# Altium schematic sheet Switch Matrix Driver.SchDoc
size A4; Organization: Altium Limited; Address1: L3, 12a Rodborough Rd; Address2: Frenchs Forest; Address3: NSW; Address4: Australia 2086
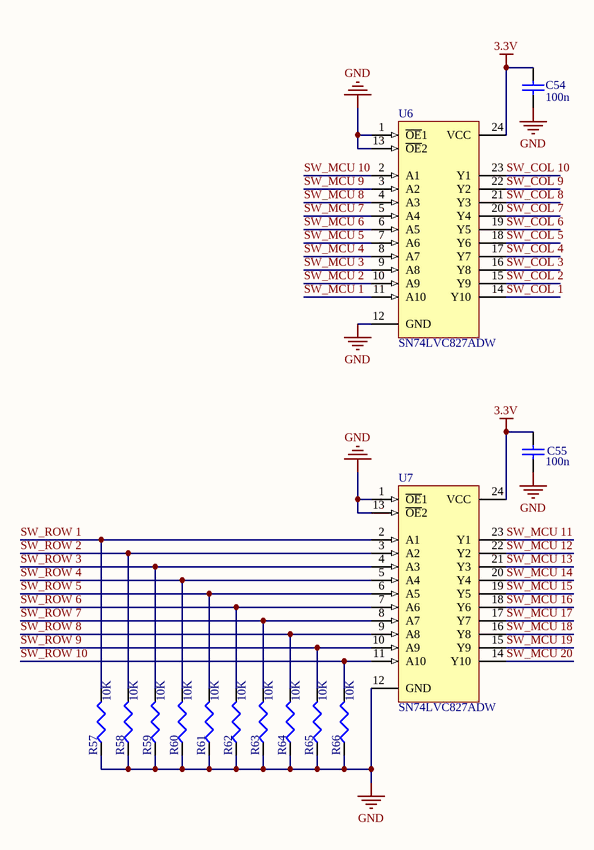
[diagram p0: Switch Matrix Driver.SchDoc]

## Parts
C54  value 100n  [0805C-GENERIC]  (hidden comment: Cap Semi)
C55  value 100n  [0805C-GENERIC]  (hidden comment: Cap Semi)
R57  value 10K  [0805R-GENERIC]  (hidden comment: Res3)
R58  value 10K  [0805R-GENERIC]  (hidden comment: Res3)
R59  value 10K  [0805R-GENERIC]  (hidden comment: Res3)
R60  value 10K  [0805R-GENERIC]  (hidden comment: Res3)
R61  value 10K  [0805R-GENERIC]  (hidden comment: Res3)
R62  value 10K  [0805R-GENERIC]  (hidden comment: Res3)
R63  value 10K  [0805R-GENERIC]  (hidden comment: Res3)
R64  value 10K  [0805R-GENERIC]  (hidden comment: Res3)
R65  value 10K  [0805R-GENERIC]  (hidden comment: Res3)
R66  value 10K  [0805R-GENERIC]  (hidden comment: Res3)
U6  SN74LVC827ADW  [SOIC24]
U7  SN74LVC827ADW  [SOIC24]

## Nets
3.3V: C54.2 C55.2 U6.24(VCC) U7.24(VCC)
GND: C54.1 C55.1 R57.1 R58.1 R59.1 R60.1 R61.1 R62.1 R63.1 R64.1 R65.1 R66.1 U6.1(~{OE}1) U6.12(GND) U6.13(~{OE}2) U7.1(~{OE}1) U7.12(GND) U7.13(~{OE}2)
SW_COL 1: U6.14(Y10)
SW_COL 2: U6.15(Y9)
SW_COL 3: U6.16(Y8)
SW_COL 4: U6.17(Y7)
SW_COL 5: U6.18(Y6)
SW_COL 6: U6.19(Y5)
SW_COL 7: U6.20(Y4)
SW_COL 8: U6.21(Y3)
SW_COL 9: U6.22(Y2)
SW_COL 10: U6.23(Y1)
SW_MCU 1: U6.11(A10)
SW_MCU 2: U6.10(A9)
SW_MCU 3: U6.9(A8)
SW_MCU 4: U6.8(A7)
SW_MCU 5: U6.7(A6)
SW_MCU 6: U6.6(A5)
SW_MCU 7: U6.5(A4)
SW_MCU 8: U6.4(A3)
SW_MCU 9: U6.3(A2)
SW_MCU 10: U6.2(A1)
SW_MCU 11: U7.23(Y1)
SW_MCU 12: U7.22(Y2)
SW_MCU 13: U7.21(Y3)
SW_MCU 14: U7.20(Y4)
SW_MCU 15: U7.19(Y5)
SW_MCU 16: U7.18(Y6)
SW_MCU 17: U7.17(Y7)
SW_MCU 18: U7.16(Y8)
SW_MCU 19: U7.15(Y9)
SW_MCU 20: U7.14(Y10)
SW_ROW 1: R57.2 U7.2(A1)
SW_ROW 2: R58.2 U7.3(A2)
SW_ROW 3: R59.2 U7.4(A3)
SW_ROW 4: R60.2 U7.5(A4)
SW_ROW 5: R61.2 U7.6(A5)
SW_ROW 6: R62.2 U7.7(A6)
SW_ROW 7: R63.2 U7.8(A7)
SW_ROW 8: R64.2 U7.9(A8)
SW_ROW 9: R65.2 U7.10(A9)
SW_ROW 10: R66.2 U7.11(A10)

## Notes on the sheet
- Title
- Size:
- Date:
- A4
- Number:
- Time:
- Revision:
- Sheet
- of
- File:

## Library data of the parts
C54 C55 = Cap Semi: Capacitor (Semiconductor SIM Model); Published: 8-Jun-2000; LatestRevisionDate: 29-May-2009; LatestRevisionNote: IPC-7351 Footprint Added.; PackageReference: C1206; Publisher: Altium Limited; PackageDescription: Chip Capacitor
R57-R66 = Res3: Resistor; Published: 8-Jun-2000; LatestRevisionDate: 29-May-2009; LatestRevisionNote: IPC-7351 Footprint Added.; PackageReference: J1-0603; Publisher: Altium Limited; PackageDescription: Chip Resistor
U6 U7 = SN74LVC827ADW: 10-Bit Buffer/Driver with 3-State Outputs; Published: 8-Jun-2000; LatestRevisionDate: 13-Apr-2006; LatestRevisionNote: IPC-7351 Footprint Added.; DatasheetVersion: Jun-1998; PackageVersion: Mar-2000; PackageReference: DW024; Publisher: Altium Limited; PackageDescription: 24-Pin Plastic Small Outline Integrated Circuit 1.27 mm Pitch; Code_JEDEC: MS-013; ComponentLink1Description: Manufacturer Link; ComponentLink1URL: http://www.ti.com/; ComponentLink2Description: Datasheet; ComponentLink2URL: http://www-s.ti.com/sc/ds/sn74lvc827a.pdf